# EAGLE design Plakat_залипуха (EAGLE 7.5.0)
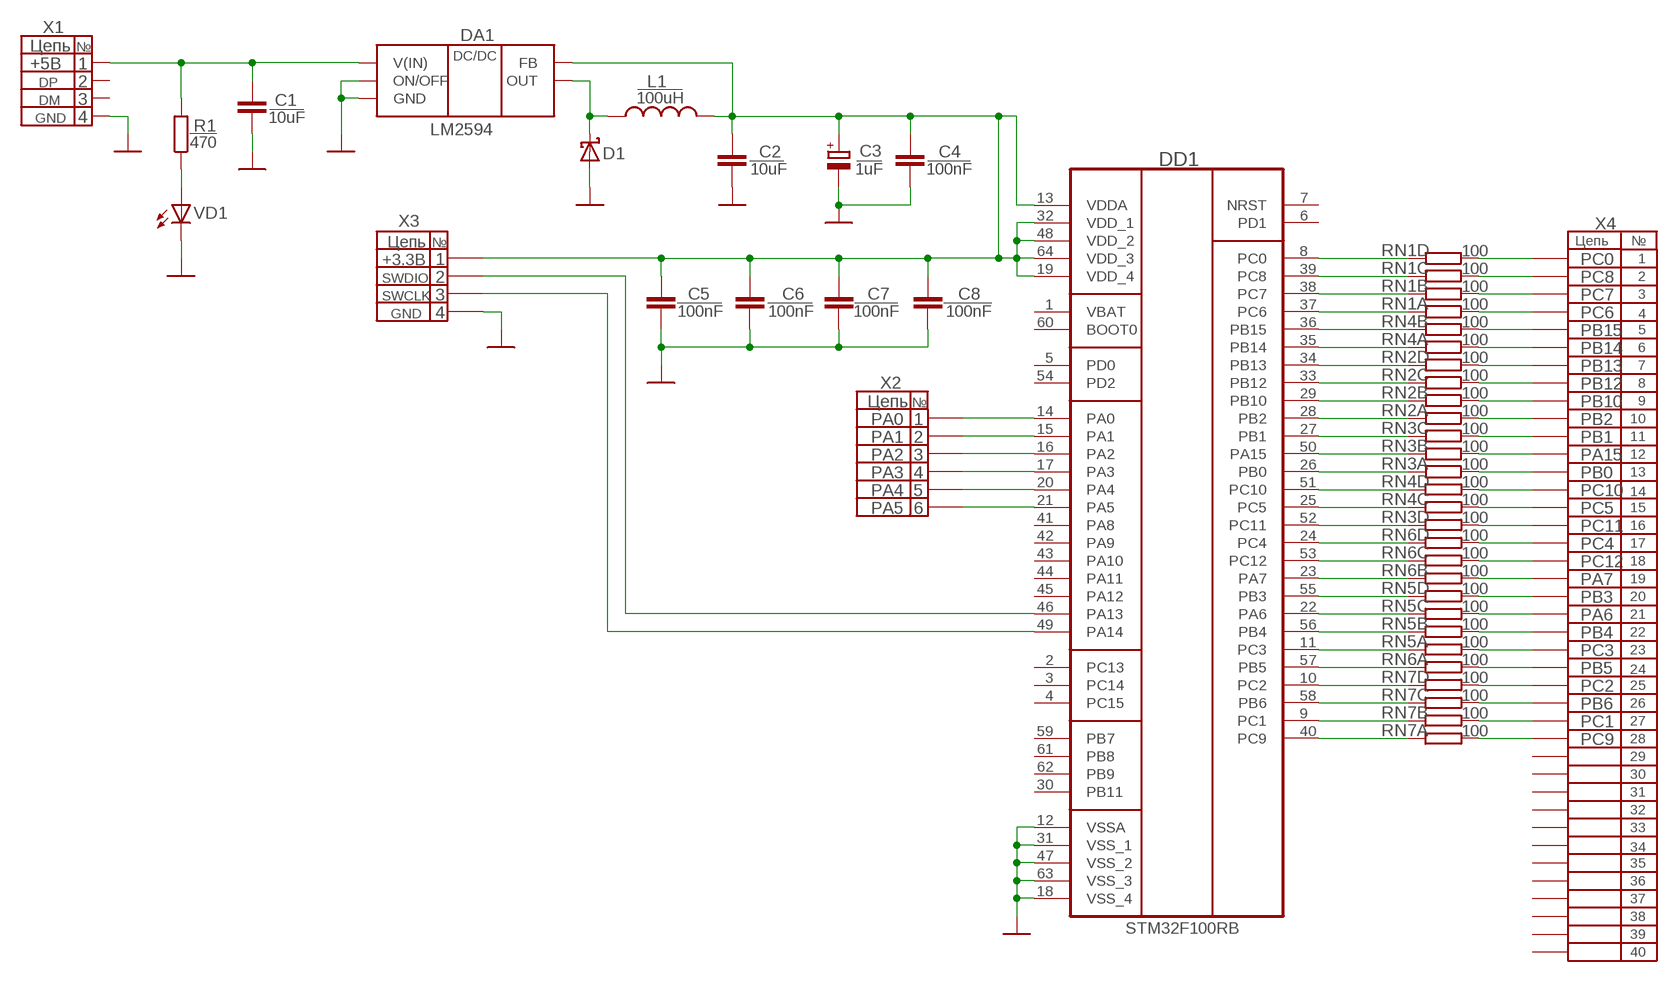
[diagram p0: schematic, sheet 1]

## Parts
C1  10uF  C-EUC0805  [C0805]
C2  10uF  C-EUC0805  [C0805]
C3  1uF  CPOL-EU  [TYPE_A_TECAP]
C4  100nF  C-EUC0805  [C0805]
C5  100nF  C-EUC0805  [C0805]
C6  100nF  C-EUC0805  [C0805]
C7  100nF  C-EUC0805  [C0805]
C8  100nF  C-EUC0805  [C0805]
D1  1N5819-T  [DO41-7.6]
DA1  LM2594  [LM2495]
DD1  STM32F100R6T6B  [QFP50P1200X1200X160-64N]
L1  100uH  SRD0604-101KL  [101KL]
R1  470  R  [R0805]
RN1  100  4R-N0603-ARC  [0603-ARC]
RN2  100  4R-N0603-ARC  [0603-ARC]
RN3  100  4R-N0603-ARC  [0603-ARC]
RN4  100  4R-N0603-ARC  [0603-ARC]
RN5  100  4R-N0603-ARC  [0603-ARC]
RN6  100  4R-N0603-ARC  [0603-ARC]
RN7  100  4R-N0603-ARC  [0603-ARC]
VD1  LED_E  [LED_1206]
X1  USB-MICROB  [USB-MICROB]
X2  PINHD-1X6  [1X06]
X3  PINHD-1X4  [1X04]
X4  PINHD-2X20  [2X20]

## Nets
GND: C1.2 C2.2 C3.- C4.2 C5.2 C6.2 C7.2 C8.2 D1.A DA1.GND DA1.ON/OFF DD1.12(VSSA) DD1.18(VSS_4) DD1.31(VSS_1) DD1.47(VSS_2) DD1.63(VSS_3) VD1.C X1.GND X1.MT1(GND) X1.MT2(GND) X3.4
N$1: C1.1 DA1.V(IN) R1.2 X1.D+
N$2: D1.C DA1.OUT L1.2
N$3: DD1.14(PA0) X2.1
N$4: R1.1 VD1.A
N$5: DD1.8(PC0) RN1.4
N$6: DD1.15(PA1) X2.2
N$7: DD1.39(PC8) RN1.3
N$8: DD1.16(PA2) X2.3
N$9: DD1.17(PA3) X2.4
N$10: DD1.20(PA4) X2.5
N$11: DD1.21(PA5) X2.6
N$12: DD1.38(PC7) RN1.2
N$13: DD1.37(PC6) RN1.1
N$14: DD1.36(PB15) RN4.2
N$15: DD1.35(PB14) RN4.1
N$16: DD1.34(PB13) RN2.4
N$17: DD1.33(PB12) RN2.3
N$18: DD1.29(PB10) RN2.2
N$19: DD1.28(PB2) RN2.1
N$20: DD1.27(PB1) RN3.3
N$21: DD1.50(PA15) RN3.2
N$22: DD1.26(PB0) RN3.1
N$23: DD1.51(PC10) RN4.5
N$24: DD1.25(PC5) RN4.6
N$25: DD1.52(PC11) RN3.5
N$26: DD1.24(PC4) RN6.5
N$27: DD1.53(PC12) RN6.6
N$28: DD1.23(PA7) RN6.7
N$29: DD1.55(PB3) RN5.5
N$32: DD1.22(PA6) RN5.6
N$33: DD1.56(PB4) RN5.7
N$34: DD1.11(PC3) RN5.8
N$35: DD1.57(PB5) RN6.8
N$36: DD1.10(PC2) RN7.5
N$37: DD1.58(PB6) RN7.6
N$38: DD1.9(PC1) RN7.7
N$39: DD1.40(PC9) RN7.8
N$40: RN1.5 X4.1
N$41: RN1.6 X4.2
N$42: RN1.7 X4.3
N$43: RN1.8 X4.4
N$44: RN4.7 X4.5
N$45: RN4.8 X4.6
N$46: RN2.5 X4.7
N$47: RN2.6 X4.8
N$48: RN2.7 X4.9
N$49: RN2.8 X4.10
N$50: RN3.6 X4.11
N$51: RN3.7 X4.12
N$52: RN3.8 X4.13
N$53: RN4.4 X4.14
N$54: RN4.3 X4.15
N$55: RN3.4 X4.16
N$56: RN6.4 X4.17
N$57: RN6.3 X4.18
N$58: RN6.2 X4.19
N$59: RN5.4 X4.20
N$60: RN5.3 X4.21
N$61: RN5.2 X4.22
N$62: RN5.1 X4.23
N$63: RN6.1 X4.24
N$64: RN7.4 X4.25
N$65: RN7.3 X4.26
N$66: RN7.2 X4.27
N$67: RN7.1 X4.28
N$71: C2.1 C3.+ C4.1 C5.1 C6.1 C7.1 C8.1 DA1.FB DD1.13(VDDA) DD1.19(VDD_4) DD1.32(VDD_1) DD1.48(VDD_2) DD1.64(VDD_3) L1.1 X3.1
SWCLK: DD1.49(PA14) X3.3
SWDIO: DD1.46(PA13) X3.2
Unconnected: DD1.2(PC13) DD1.3(PC14) DD1.4(PC15) DD1.5(PD0) DD1.6(PD1) DD1.7(NRST) DD1.30(PB11) DD1.41(PA8) DD1.42(PA9) DD1.43(PA10) DD1.44(PA11) DD1.45(PA12) DD1.54(PD2) DD1.59(PB7) DD1.60(BOOT0) DD1.61(PB8) DD1.62(PB9) X1.D- X1.VBUS X4.29 X4.30 X4.31 X4.32 X4.33 X4.34 X4.35 X4.36 X4.37 X4.38 X4.39 X4.40

## Notes on the sheet
- Цепь | №
- +5В | 1
- DP | 2
- DM | 3 | 100uH
- GND | 4 | 10uF
- 470
- 10uF | 1uF | 100nF
- Цепь | №
- 100
- +3.3В | 1 | PC0
- 100
- SWDIO | 2 | PC8
- 100
- SWCLK | 3 | PC7
- 100
- GND | 4 | 100nF | 100nF | 100nF | 100nF | PC6
- 100
- PB15
- 100
- PB14
- 100
- PB13
- 100
- PB12
- 100
- Цепь | № | PB10
- 100
- PA0 | 1 | PB2
- 100
- PA1 | 2 | PB1
- 100
- PA2 | 3 | PA15
- 100
- PA3 | 4 | PB0
- 100
- PA4 | 5 | PC10
- 100
- PA5 | 6 | PC5
- 100
- PC11
- 100
- PC4
- 100
- PC12
- 100
- PA7
- 100
- PB3
- 100
- PA6
- 100
- PB4
- 100
- PC3
- 100
- PB5
- 100
- PC2
- 100
- PB6
- 100
- PC1
- 100
- PC9
- STM32F100RB

## Power pins joined to a net without a drawn wire
VBAT: DD1.1(VBAT)

## Library data of the parts
C1 C2 C4-C8 = rcl:C-EU: CAPACITOR, European symbol
C3 = rcl:CPOL-EU: POLARIZED CAPACITOR, European symbol
D1 = diode:1N581*: 1.0A SCHOTTKY BARRIER RECTIFIER Source: http://www.diodes.com/datasheets/ds23001.pdf
DA1 = LM2594:LM2594
DD1 = ST Microelctronics_By_element14_Batch_1:STM32F100R6T6B: ARM-based 32-bit MCU; MPN: STM32F100R6T6B; OC_FARNELL: 1838506; OC_NEWARK: 76R0991; PACKAGE: QFP-64; SUPPLIER: STMICROELECTRONICS
L1 = BOURNS:SRD0604-101KL
R1 = eagle-ltspice:R: RESISTOR, European symbol; SPICEMODEL: NONE; SPICEPREFIX: R
RN1-RN7 = resistor-dil:4R-N: Array Chip Resistor Source: RS Component / Phycomp; OC_FARNELL: unknown; OC_NEWARK: unknown
VD1 = eagle-ltspice:LED_E: LED Source: http://www.osram.convergy.de Source: www.luxeon.com Source: www.kingbright.com; SPICEMODEL: NONE; SPICEPREFIX: D; SPICETYPE: diode
X1 = SparkFun-Connectors:USB: USB Connectors USB-B-PTH is fully proven SKU : PRT-00139/CONN-08278 USB-miniB is fully proven SKU : PRT-00587 USB-A-PCB is untested. USB-A-H is throughly reviewed, but untested. Spark Fun Electronics SKU : PRT-00437 USB-B-SMT is throughly reviewed, but untested. Needs silkscreen touching up. USB-A-S has not been used/tested USB-MB-H has not been used/tested USB-MICROB has been used. CONN-09505; PROD_ID: CONN-09505
X2 = pinhead:PINHD-1X6: PIN HEADER
X3 = pinhead:PINHD-1X4: PIN HEADER
X4 = pinhead:PINHD-2X20: PIN HEADER

## Board
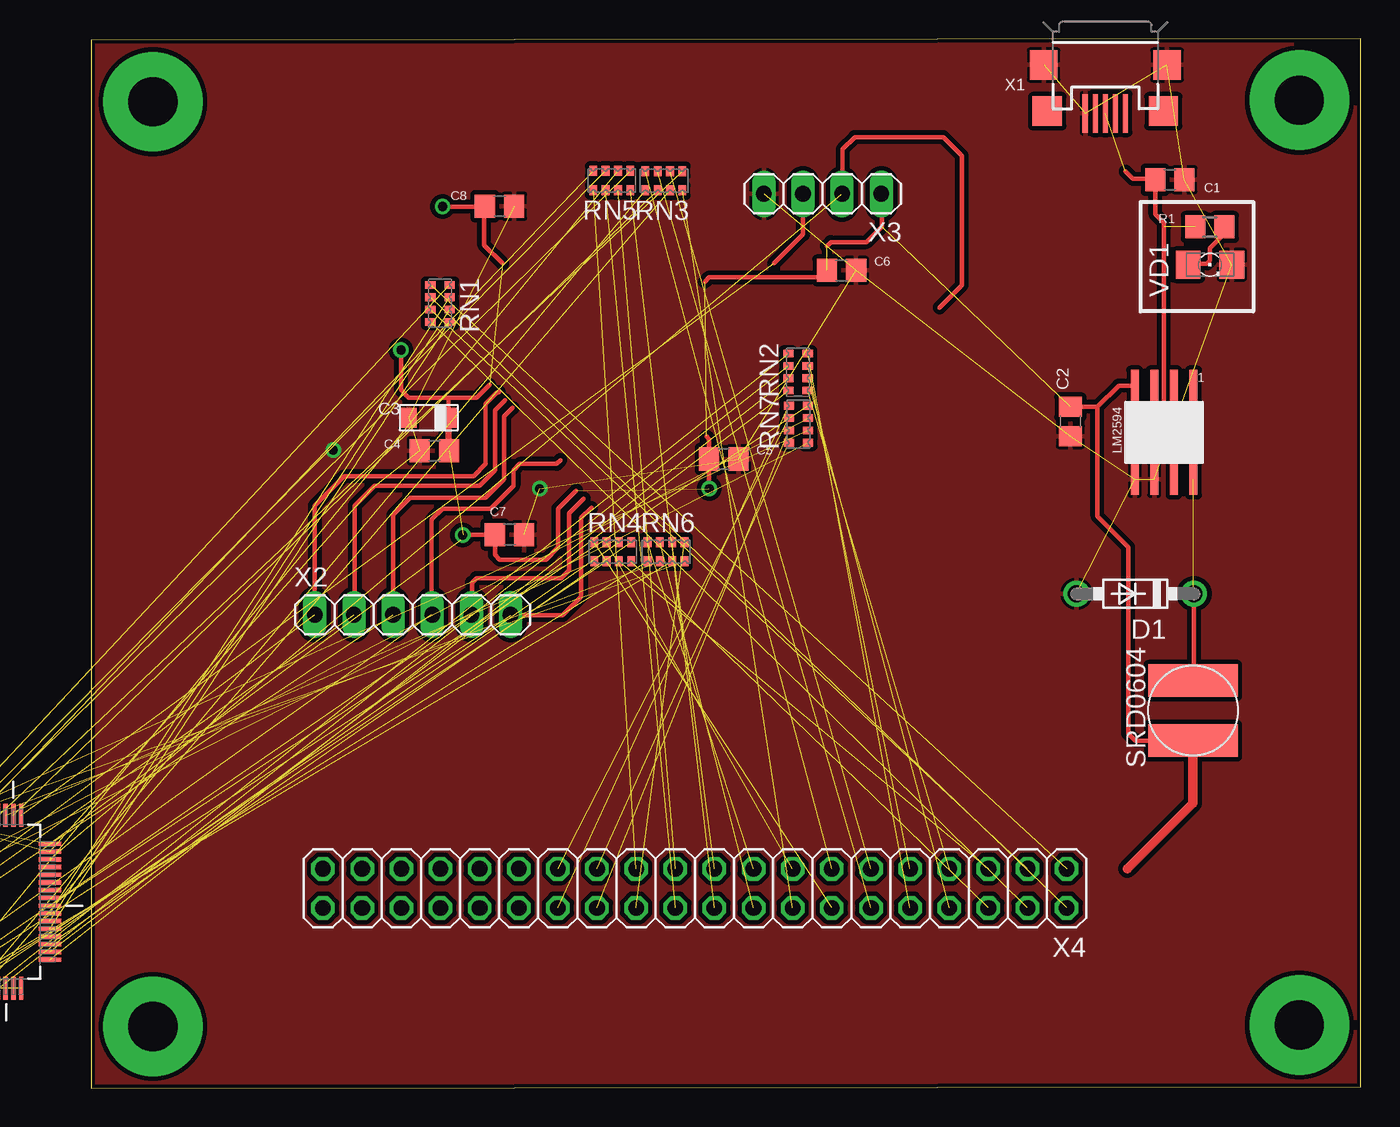
[diagram p1: board, top side]
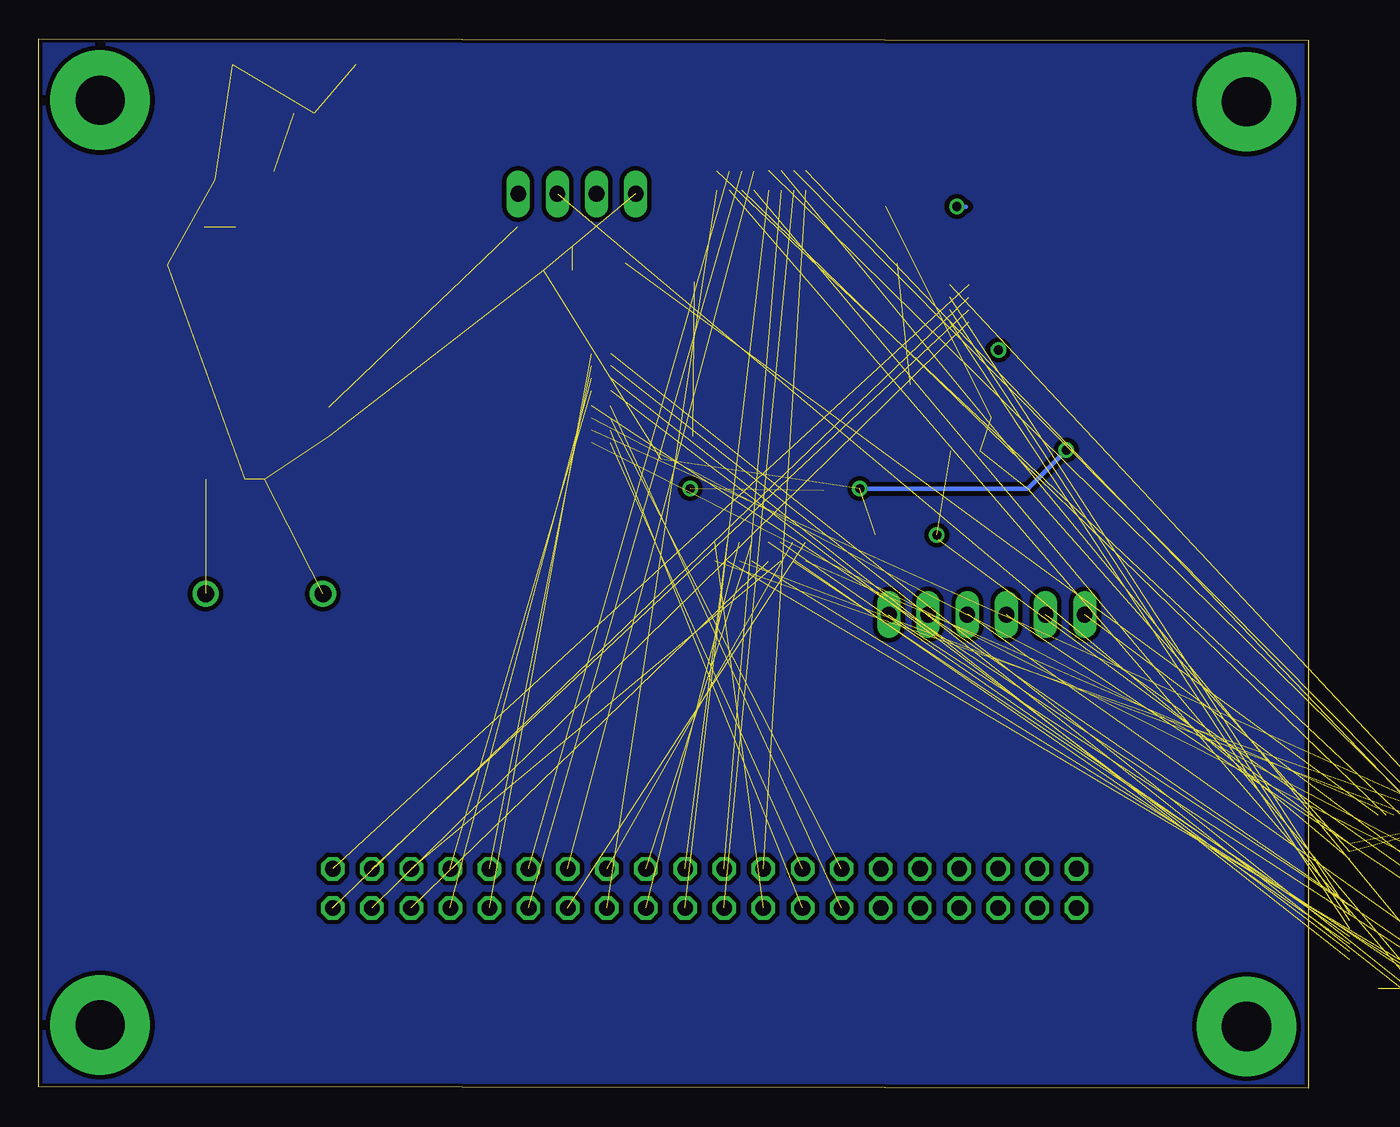
[diagram p2: board, bottom side, seen from below]

Size 82.4 x 68.1 mm. Coordinates in mm from the lower left corner, seen from the top.
Outline: 0,0 82.4,0.1 82.4,68.1 0,68 0,0
Copper layers (1*16): Top 0.105mm / dielectric 1.55mm / Bottom 0.105mm
Design rules "eC_2Layer_PClass3_BaseCopperO105": minimum track width 0.25mm, minimum drill 0.35mm, track to track 0.3mm, track to pad 0.3mm, pad to pad 0.3mm, via to via 0.3mm, smd to smd 0mil, copper to edge 0.25mm, drill to drill 0.35mm, minimum pad ring 0.25mm, minimum via ring 0.2mm, stop-mask expansion 0mil, vias tented up to drill 0.45mm, thermal gap 0.2mm

### Footprints (pad centres in the part's own frame; a part is rotated, then mirrored left to right if it is on the bottom)
C0805 = smd 1.3 x 1.5: 1 -0.95,0; 2 0.95,0
TYPE_A_TECAP = smd 1 x 1.27: + 2.9,0.6; - 0.3,0.6
DO41-7.6 = drill 1.1 pad 1.7: A 3.81,0; C -3.81,0
LM2495 = smd 0.51 x 2.032: FB 1.905,-3.035; GND 0.635,3.035; ON/OFF 1.905,3.035; OUT -1.905,3.035; P$5 -0.635,-3.035; P$6 -1.905,-3.035; P$8 0.635,-3.035; V(IN) -0.635,3.035
QFP50P1200X1200X160-64N = smd 1.473 x 0.279: 1 -5.613,3.759; 2 -5.613,3.251; 3 -5.613,2.743; 4 -5.613,2.261; 5 -5.613,1.753; 6 -5.613,1.245; 7 -5.613,0.762; 8 -5.613,0.254; 9 -5.613,-0.254; 10 -5.613,-0.762; 11 -5.613,-1.245; 12 -5.613,-1.753; 13 -5.613,-2.261; 14 -5.613,-2.743; 15 -5.613,-3.251; 16 -5.613,-3.759; 33 5.613,-3.759; 34 5.613,-3.251; 35 5.613,-2.743; 36 5.613,-2.261; 37 5.613,-1.753; 38 5.613,-1.245; 39 5.613,-0.762; 40 5.613,-0.254; 41 5.613,0.254; 42 5.613,0.762; 43 5.613,1.245; 44 5.613,1.753; 45 5.613,2.261; 46 5.613,2.743; 47 5.613,3.251; 48 5.613,3.759 | smd 0.279 x 1.473: 17 -3.759,-5.613; 18 -3.251,-5.613; 19 -2.743,-5.613; 20 -2.261,-5.613; 21 -1.753,-5.613; 22 -1.245,-5.613; 23 -0.762,-5.613; 24 -0.254,-5.613; 25 0.254,-5.613; 26 0.762,-5.613; 27 1.245,-5.613; 28 1.753,-5.613; 29 2.261,-5.613; 30 2.743,-5.613; 31 3.251,-5.613; 32 3.759,-5.613; 49 3.759,5.613; 50 3.251,5.613; 51 2.743,5.613; 52 2.261,5.613; 53 1.753,5.613; 54 1.245,5.613; 55 0.762,5.613; 56 0.254,5.613; 57 -0.254,5.613; 58 -0.762,5.613; 59 -1.245,5.613; 60 -1.753,5.613; 61 -2.261,5.613; 62 -2.743,5.613; 63 -3.251,5.613; 64 -3.759,5.613
101KL = smd 2.1 x 5.8: 1 -1.95,0; 2 1.95,0
R0805 = smd 1.3 x 1.5: 1 -0.95,0; 2 0.95,0
0603-ARC = smd 0.5 x 0.65: 1 -1.2,-0.625; 2 -0.4,-0.625; 3 0.4,-0.625; 4 1.2,-0.625; 5 1.2,0.625; 6 0.4,0.625; 7 -0.4,0.625; 8 -1.2,0.625
LED_1206 = smd 1.6 x 1.803: A -1.422,0; C 1.422,0
USB-MICROB = smd 0.35 x 2.5: D+ 0,3.15; D- -0.65,3.15; GND 1.3,3.15; ID 0.65,3.15; VBUS -1.3,3.15 | smd 1.8 x 1.9: MT1 -4,0; MT2 4,0 | smd 1.9 x 1.9: P$1 -3.77,3; P$2 3.77,3
1X06 = drill 1.016 long: 1 -6.35,0; 2 -3.81,0; 3 -1.27,0; 4 1.27,0; 5 3.81,0; 6 6.35,0
1X04 = drill 1.016 long: 1 -3.81,0; 2 -1.27,0; 3 1.27,0; 4 3.81,0
2X20 = drill 1.016 octagon: 1 -24.13,-1.27; 2 -24.13,1.27; 3 -21.59,-1.27; 4 -21.59,1.27; 5 -19.05,-1.27; 6 -19.05,1.27; 7 -16.51,-1.27; 8 -16.51,1.27; 9 -13.97,-1.27; 10 -13.97,1.27; 11 -11.43,-1.27; 12 -11.43,1.27; 13 -8.89,-1.27; 14 -8.89,1.27; 15 -6.35,-1.27; 16 -6.35,1.27; 17 -3.81,-1.27; 18 -3.81,1.27; 19 -1.27,-1.27; 20 -1.27,1.27; 21 1.27,-1.27; 22 1.27,1.27; 23 3.81,-1.27; 24 3.81,1.27; 25 6.35,-1.27; 26 6.35,1.27; 27 8.89,-1.27; 28 8.89,1.27; 29 11.43,-1.27; 30 11.43,1.27; 31 13.97,-1.27; 32 13.97,1.27; 33 16.51,-1.27; 34 16.51,1.27; 35 19.05,-1.27; 36 19.05,1.27; 37 21.59,-1.27; 38 21.59,1.27; 39 24.13,-1.27; 40 24.13,1.27

### Placement (x,y rotation side)
C1  69.99,58.94 0 top
C2  63.54,43.26 270 top
C3  20.3,42.9 0 top
C4  22.27,41.36 180 top
C5  41.04,40.82 0 top
C6  48.69,53.06 0 top
C7  27.14,35.92 0 top
C8  26.49,57.22 0 top
D1  67.75,32.08 180 top
DA1  69.62,42.55 180 top
DD1  -8.3,12.1 0 top
L1  71.5,24.5 90 top
R1  72.59,55.88 180 top
RN1  22.63,50.92 90 top
RN2  45.87,46.46 270 top
RN3  37.16,58.87 0 top
RN4  33.84,34.81 180 top
RN5  33.78,58.89 0 top
RN6  37.3,34.81 180 top
RN7  45.89,43.08 270 top
VD1  72.6,53.42 0 top
X1  65.81,66.39 180 top
X2  20.86,30.72 0 top
X3  47.46,58.03 180 top
X4  39.17,12.97 180 top

### Tracks (layer width: path | path; a pad name or v marks a point on that pad's centre or on a via)
GND  (via drill 0.6)  (21 unrouted)
  Bottom 0.305: v29.1,38.9 18.2,38.9 v15.7,41.4
  pour Top: 0,68 82.4,68 82.4,0.1 0,0.1
N$1  (2 unrouted)
  Top 0.305: 67.11,59.49 67.6,59 68.98,59 C1.1 69.06,58.92 69.06,56.69 69.6,56.15 69.6,55.9 | DA1.V(IN) 70.25,43.64 69.6,44.3 69.6,55.9 | 69.62,55.88 69.6,55.9
N$2  (1 unrouted)
  Top 0.305: 71.53,32.12 D1.C 71.56,26.51 L1.2
N$3  (1 unrouted)
  Top 0.305: 26.46,45.16 arc45 26.28,45.08 25.6,44.4 25.6,40.5 24.8,39.7 16.4,39.7 14.5,37.8 X2.1
N$4
  Top 0.305: VD1.A 71.56,53.8 71.86,53.5 72.4,53.5 72.6,53.7 72.6,54.5 73.54,55.44 R1.1
N$5  (1 unrouted)
N$6  (1 unrouted)
  Top 0.305: 26.85,44.65 26.2,44 26.2,40.1 25.2,39.1 18.4,39.1 17.1,37.8 17.1,30.77 X2.2
N$7  (1 unrouted)
N$8  (1 unrouted)
  Top 0.305: 27.34,44.14 26.8,43.6 26.8,39.5 25.6,38.3 20.7,38.3 19.6,37.2 X2.3
N$9  (1 unrouted)
  Top 0.305: 30.45,40.75 30.2,40.5 27.8,40.5 27.4,40.1 27.4,39.1 25.9,37.6 22.8,37.6 22.1,36.9 22.1,30.75 X2.4
N$10  (1 unrouted)
  Top 0.305: 31.95,38.25 31,37.3 31,33.6 30.5,33.1 25,33.1 24.7,32.8 24.7,30.75 X2.5
N$11  (1 unrouted)
  Top 0.305: 32.46,37.66 31.8,37 31.8,31.9 30.6,30.7 27.23,30.7 X2.6
N$12  (1 unrouted)
N$13  (1 unrouted)
N$14  (1 unrouted)
N$15  (1 unrouted)
N$16  (1 unrouted)
N$17  (1 unrouted)
N$18  (1 unrouted)
N$19  (1 unrouted)
N$20  (1 unrouted)
N$21  (1 unrouted)
N$22  (1 unrouted)
N$23  (1 unrouted)
N$24  (1 unrouted)
N$25  (1 unrouted)
N$26  (1 unrouted)
N$27  (1 unrouted)
N$28  (1 unrouted)
N$29  (1 unrouted)
N$30  (via drill 3.2 pad 6.45)
  other vias: 4,64
N$31  (via drill 3.2 pad 6.45)
  other vias: 4,4
N$32  (1 unrouted)
N$33  (1 unrouted)
N$34  (1 unrouted)
N$35  (1 unrouted)
N$36  (1 unrouted)
N$37  (1 unrouted)
N$38  (1 unrouted)
N$39  (1 unrouted)
N$40  (1 unrouted)
N$41  (1 unrouted)
N$42  (1 unrouted)
N$43  (1 unrouted)
N$44  (1 unrouted)
N$45  (1 unrouted)
N$46  (1 unrouted)
N$47  (1 unrouted)
N$48  (1 unrouted)
N$49  (1 unrouted)
N$50  (1 unrouted)
N$51  (1 unrouted)
N$52  (1 unrouted)
N$53  (1 unrouted)
N$54  (1 unrouted)
N$55  (1 unrouted)
N$56  (1 unrouted)
N$57  (1 unrouted)
N$58  (1 unrouted)
N$59  (1 unrouted)
N$60  (1 unrouted)
N$61  (1 unrouted)
N$62  (1 unrouted)
N$63  (1 unrouted)
N$64  (1 unrouted)
N$65  (1 unrouted)
N$66  (1 unrouted)
N$67  (1 unrouted)
N$68  (via drill 3.2 pad 6.45)
  other vias: 78.4,4.1
N$69  (via drill 3.2 pad 6.45)
  other vias: 78.4,64.1
N$71  (via drill 0.6)  (11 unrouted)
  Top 0.305: 39.91,42.29 40.1,42.1 C5.1 | 26.69,53.51 25.5,54.7 25.5,57.18 | 39.82,52.32 40.1,52.6 47.28,52.6 C6.1 | 25.5,57.18 22.82,57.18 v22.8,57.2 | 25.5,57.18 C8.1 | v24.1,35.9 24.12,35.92 C7.1 26.2,34.6 26.5,34.3 29.5,34.3 30.3,35.1 30.3,37.6 31.47,38.77 | C5.1 v40.1,38.9 | C5.1 | 47.74,54.64 48,54.9 50.3,54.9 51.3,55.9 51.3,58 X3.1 | 25.84,45.64 25,44.8 23.21,44.8 | 23.22,44.78 23.21,44.8 | DA1.FB 66.69,45.59 65.3,44.2 | 65.3,44.2 C2.1 | L1.1 67.75,22.55 67.3,23 67.3,35.1 65.3,37.1 65.3,44.2 | 23.21,44.8 20.6,44.8 20.1,45.3 v20.1,47.9 | C3.+ 23.2,44.8 23.21,44.8
  Top 0.406: C4.1 23.2,41.36 C3.+
  Top 0.61: 67.24,14.24 71.5,18.5 L1.1
  Bottom 0.305: v22.8,57.2 22.2,57.2 | v24.1,35.9 24.1,35.7 24,35.6 | v20.1,47.9 20.4,47.9 20.5,48
SWCLK  (1 unrouted)
  Top 0.305: 44.31,53.51 46.2,55.4 X3.3
SWDIO  (1 unrouted)
  Top 0.305: 48.7,58 X3.2 48.76,58.06 48.76,60.91 49.55,61.7 55.3,61.7 56.5,60.5 56.5,52.1 55.04,50.64
VCC
  pour Bottom: 0,68 82.4,68 82.4,0.1 0,0.1